# Altium project CoilWinderPCB.PrjPcb
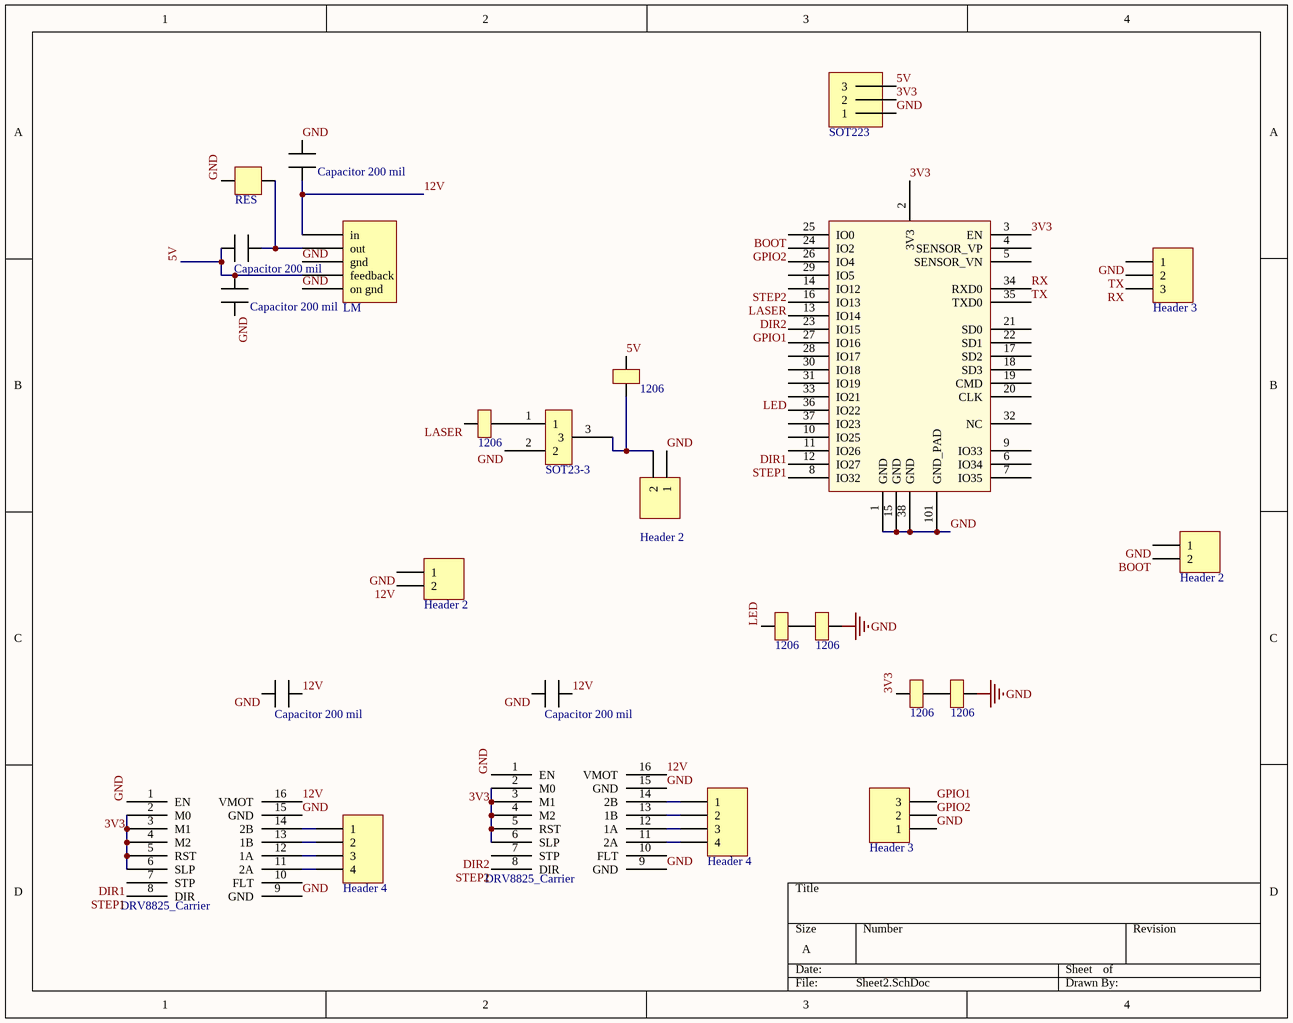
[diagram p0: Sheet2.SchDoc]
1 sheet, 25 parts. Net scope: global (net labels, ports and power ports of the same name join across sheets).
Board file: PCB2.PcbDoc

## Sheet Sheet2.SchDoc
size A

### Parts
1  SOT223  [SOT223]
2  1206  [1206]
3  1206  [1206]
4  1206  [1206]
5  1206  [1206]
6  1206  [1206]
7  1206  [1206]
*1  DRV8825_Carrier  [DRV8825 Carrier]
*2  DRV8825_Carrier  [DRV8825 Carrier]
*3  SOT23-3  [SOT23-3]
C1  Capacitor 200 mil  [circular 200 mil]
C2  Capacitor 200 mil  [circular 200 mil]
C3  Capacitor 200 mil  [circular 200 mil]
C4  Capacitor 200 mil  [circular 200 mil]
C5  Capacitor 200 mil  [circular 200 mil]
LM1  LM  [TO 22Ö]
M1  ESP32S_Module  [ESP32S_W]  (value not drawn)
P1  Header 3  [HDR1X3]
P2  Header 2  [HDR1X2]
P3  Header 2  [HDR1X2]
P4  Header 4  [HDR1X4]
P5  Header 4  [HDR1X4]
P6  Header 2  [HDR1X2]
P7  Header 3  [HDR1X3]
R1  RES  [LINEAR 100 MIL]

### Nets
GND: 1.1 5.2 7.2 *1.1(EN) *1.9(GND) *1.15(GND) *2.1(EN) *2.9(GND) *2.15(GND) *3.2 C1.1 C2.1 C3.1 C5.1 LM1.3(gnd) LM1.5(on_gnd) M1.1(GND) M1.15(GND) M1.38(GND) M1.101(GND_PAD) P1.1 P2.1 P3.1 P6.1 P7.1 R1.1
3V3: 1.2 4.1 *1.2(M0) *1.3(M1) *1.4(M2) *1.5(RST) *1.6(SLP) *2.2(M0) *2.3(M1) *2.4(M2) *2.5(RST) *2.6(SLP) M1.2(3V3) M1.3(EN)
5V: 1.3 3.2 C4.1 C5.2 LM1.4(feedback)
12V: *1.16(VMOT) *2.16(VMOT) C1.2 C2.2 C3.2 LM1.1(in) P3.2
BOOT: M1.25(IO0) P2.2
DIR1: *2.7(STP) M1.11(IO26)
DIR2: *1.7(STP) M1.13(IO14)
GPIO1: M1.23(IO15) P7.3
GPIO2: M1.24(IO2) P7.2
LASER: 2.1 M1.16(IO13)
LED: 6.1 M1.33(IO21)
RX: M1.34(RXD0) P1.3
STEP1: *2.8(DIR) M1.12(IO27)
STEP2: *1.8(DIR) M1.14(IO12)
TX: M1.35(TXD0) P1.2
Net2_2: 2.2 *3.1
Net3_1: 3.1 *3.3 P6.2
Net4_2: 4.2 5.1
Net6_2: 6.2 7.1
Net*1_11: *1.11(2A) P4.4
Net*1_12: *1.12(1A) P4.3
Net*1_13: *1.13(1B) P4.2
Net*1_14: *1.14(2B) P4.1
Net*2_11: *2.11(2A) P5.4
Net*2_12: *2.12(1A) P5.3
Net*2_13: *2.13(1B) P5.2
Net*2_14: *2.14(2B) P5.1
NetC4_2: C4.2 LM1.2(out) R1.2

Not connected (* = marked no-connect by the designer): *1 10(FLT); *2 10(FLT); M1 4(SENSOR_VP) 5(SENSOR_VN) 6(IO34) 7(IO35) 8(IO32) 9(IO33) 10(IO25) 17(SD2) 18(SD3) 19(CMD) 20(CLK) 21(SD0) 22(SD1) 26(IO4) 27(IO16) 28(IO17) 29(IO5) 30(IO18) 31(IO19) 32(NC) 36(IO22) 37(IO23)

### Library data of the parts
1 = SOT223: 3v3 regulator
*1 *2 = DRV8825_Carrier: Carrier PCB for DRV8825
C1-C5 = CAP: Capacitor 200 mil pin distance
M1 = ESP32S_Module: Esp-32S
P1 P7 = Header 3: Header, 3-Pin
P2 P3 P6 = Header 2: Header, 2-Pin
P4 P5 = Header 4: Header, 4-Pin